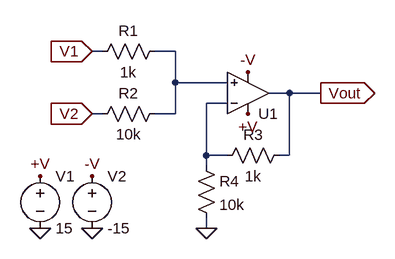
[diagram p0: schematic adder_zeta.asc]
adder_zeta.asc, the LTspice schematic file:
Version 4
SHEET 1 880 680
WIRE -48 128 -64 128
WIRE 64 128 32 128
WIRE 64 176 64 128
WIRE 144 176 64 176
WIRE 240 192 208 192
WIRE 288 192 240 192
WIRE 144 208 112 208
WIRE -48 224 -64 224
WIRE 64 224 64 176
WIRE 64 224 32 224
WIRE 112 288 112 208
WIRE 144 288 112 288
WIRE 240 288 240 192
WIRE 240 288 224 288
WIRE 112 304 112 288
WIRE 112 400 112 384
FLAG 112 400 0
FLAG -64 128 V1
IOPIN -64 128 In
FLAG -64 224 V2
IOPIN -64 224 In
FLAG 288 192 Vout
IOPIN 288 192 Out
FLAG -144 400 0
FLAG -64 400 0
FLAG -144 320 +V
FLAG 176 224 +V
FLAG -64 320 -V
FLAG 176 160 -V
SYMBOL res 48 112 R90
WINDOW 0 0 56 VBottom 2
WINDOW 3 32 56 VTop 2
SYMATTR InstName R1
SYMATTR Value 1k
SYMBOL res 48 208 R90
WINDOW 0 0 56 VBottom 2
WINDOW 3 32 56 VTop 2
SYMATTR InstName R2
SYMATTR Value 10k
SYMBOL res 240 272 R90
WINDOW 0 0 56 VBottom 2
WINDOW 3 32 56 VTop 2
SYMATTR InstName R3
SYMATTR Value 1k
SYMBOL res 96 288 R0
SYMATTR InstName R4
SYMATTR Value 10k
SYMBOL voltage -144 304 R0
WINDOW 123 0 0 Left 0
WINDOW 39 0 0 Left 0
SYMATTR InstName V1
SYMATTR Value 15
SYMBOL voltage -64 304 R0
WINDOW 123 0 0 Left 0
WINDOW 39 0 0 Left 0
SYMATTR InstName V2
SYMATTR Value -15
SYMBOL OpAmps\\UniversalOpAmp1 176 192 M180
SYMATTR InstName U1

The netlist it stands for:
* adder_zeta.asc
R1 N001 V1 1k
R2 N001 V2 10k
R3 Vout N002 1k
R4 N002 0 10k
V1 +V 0 15
V2 -V 0 -15
XU1 N001 N002 +V -V Vout level1 Avol=1Meg GBW=10Meg Vos=0 En=0 Enk=0 In=0 Ink=0 Rin=500Meg  ; pins In+ In- V+ V- OUT
.lib UniversalOpAmp1.lib
.backanno
.end